# EAGLE design EncoderInterface_J007399_T4 (EAGLE 7.7.0)
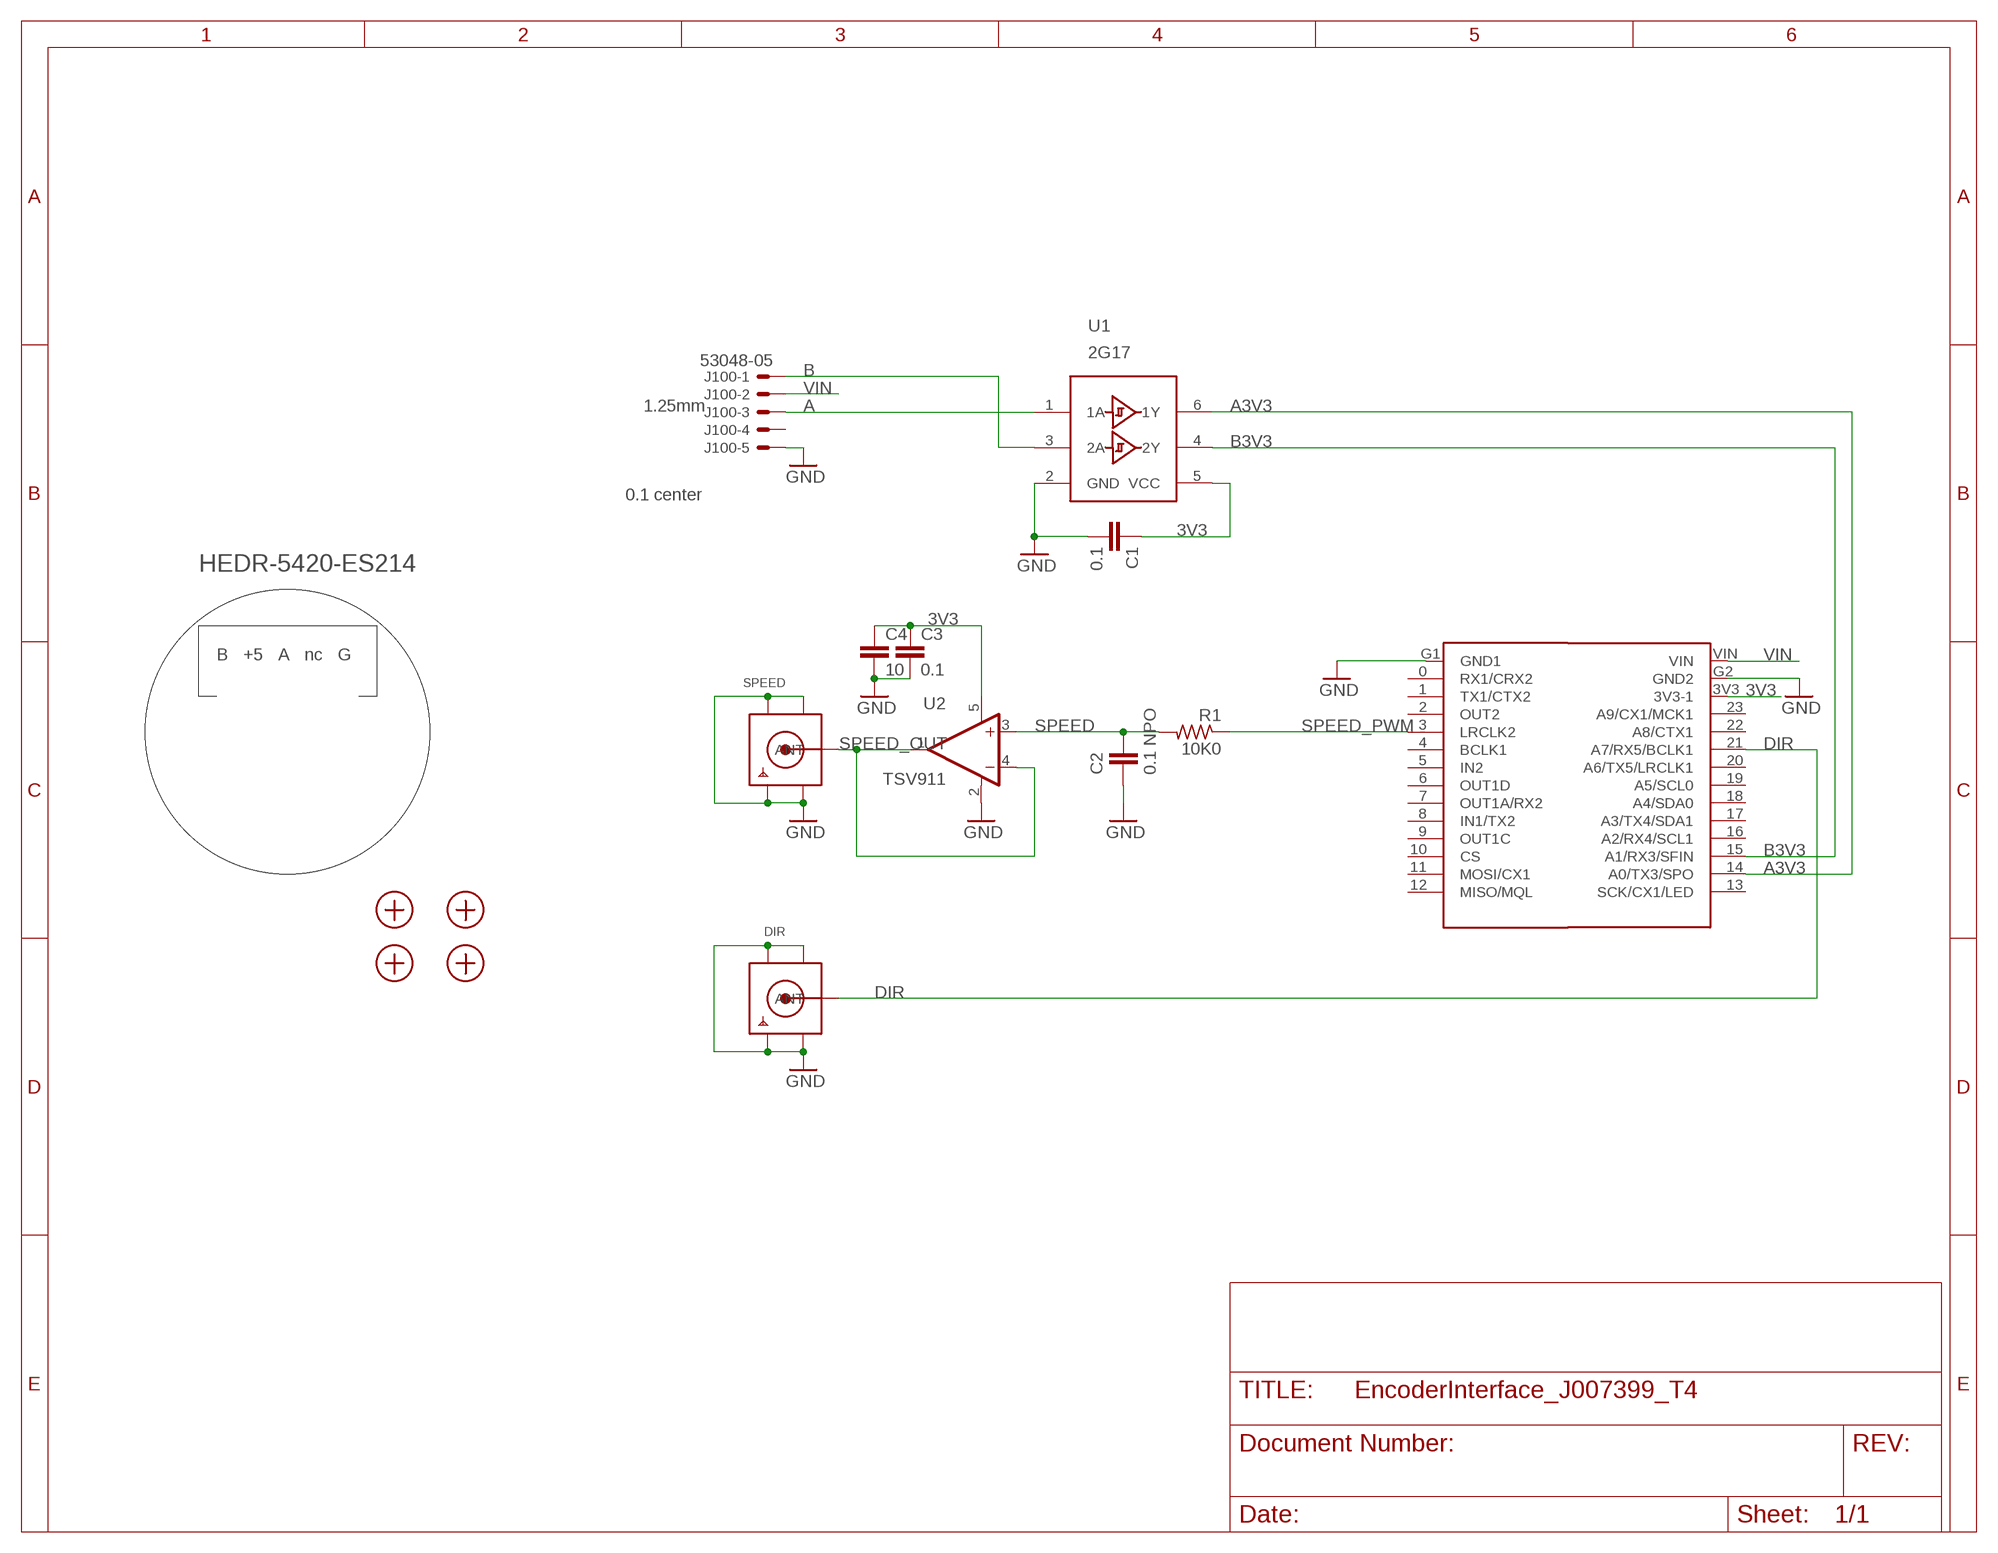
[diagram p0: schematic, sheet 1]

## Parts
C1  0.1  CAPS0603S  [0603S]
C2  0.1 NPO  CAPS1206S  [1206S]
C3  0.1  CAPS0603S  [0603S]
C4  10  CAPS1206S  [1206S]
DIR  SMACONNECTOR  [SMA90_DIP]
J100  53048-05  [53048-05]
M1A  TEENSY40A  [TEENSY40-A]
M1B  TEENSY40B  [TEENSY40-B]
R1  10K0  RESISTOR_SM0805S  [0805S]
S1  SCREW2-56SCREW  [2-56SOCKET]
S2  SCREW2-56SCREW  [2-56SOCKET]
S3  SCREW2-56SCREW  [2-56SOCKET]
S4  SCREW2-56SCREW  [2-56SOCKET]
SPEED  SMACONNECTOR  [SMA90_DIP]
U1  2G17  [SOT23-6]
U2  TSV911  OPA237N  [SOT23-5]

## Nets
3V3: C1.1 C3.1 C4.1 M1B.3V3(3V3-1) U1.5(VCC) U2.5(V+)
A: J100.3 U1.1(1A)
A3V3: M1B.14(A0/TX3/SPO) U1.6(1Y)
B: J100.1 U1.3(2A)
B3V3: M1B.15(A1/RX3/SFIN) U1.4(2Y)
DIR: DIR.ANTENNA(ANT) M1B.21(A7/RX5/BCLK1)
GND: C1.2 C2.2 C3.2 C4.2 DIR.GND1 DIR.GND2 DIR.GND3 DIR.GND4 J100.5 M1A.G1(GND1) M1B.G2(GND2) SPEED.GND1 SPEED.GND2 SPEED.GND3 SPEED.GND4 U1.2(GND) U2.2(V-)
SPEED: C2.1 R1.2 U2.3(+IN)
SPEED_OUT: SPEED.ANTENNA(ANT) U2.1(OUT) U2.4(-IN)
SPEED_PWM: M1A.3(LRCLK2) R1.1
VIN: J100.2 M1B.VIN
Unconnected: J100.4 M1A.0(RX1/CRX2) M1A.1(TX1/CTX2) M1A.2(OUT2) M1A.4(BCLK1) M1A.5(IN2) M1A.6(OUT1D) M1A.7(OUT1A/RX2) M1A.8(IN1/TX2) M1A.9(OUT1C) M1A.10(CS) M1A.11(MOSI/CX1) M1A.12(MISO/MQL) M1B.13(SCK/CX1/LED) M1B.16(A2/RX4/SCL1) M1B.17(A3/TX4/SDA1) M1B.18(A4/SDA0) M1B.19(A5/SCL0) M1B.20(A6/TX5/LRCLK1) M1B.22(A8/CTX1) M1B.23(A9/CX1/MCK1)

## Notes on the sheet
- 1.25mm
- 0.1 center
- HEDR-5420-ES214
- B   +5   A   nc   G

## Library data of the parts
C1-C4 = STEVES_BU:CAPS
DIR SPEED = adafruit:SMACONNECTOR: SMA Connector 90° DIP SMA Connector, 50 Ohm (4UConnector: 07259)
J100 = con-molex:53?-05: CONNECTOR wire to board 1.25 mm (.049 inch) pitch header; MF: MOLEX; MPN: 53048-0510; OC_FARNELL: 9732926; OC_NEWARK: 57H4722
M1A = teensy:TEENSY40A
M1B = teensy:TEENSY40B
R1 = STEVES_BU:RESISTOR_SM
S1-S4 = STEVES_BU:SCREW
U1 = STEVES_BU:2G17
U2 = burr-brown:OPA237: Operational Amplifiers Single-Supply, MicroAmplifier(TM) Series; MF: TEXAS INSTRUMENTS; MPN: OPA237NA/250; OC_FARNELL: 4625298; OC_NEWARK: 35C1874

## Board
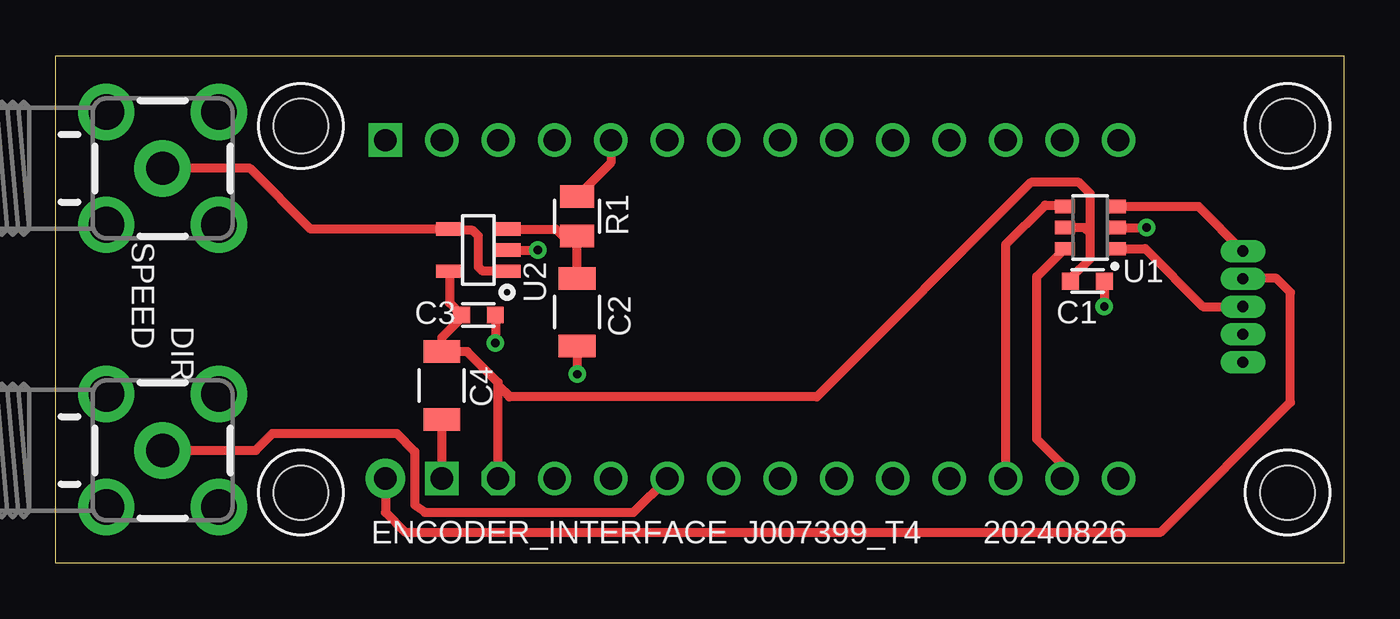
[diagram p1: board, top side]
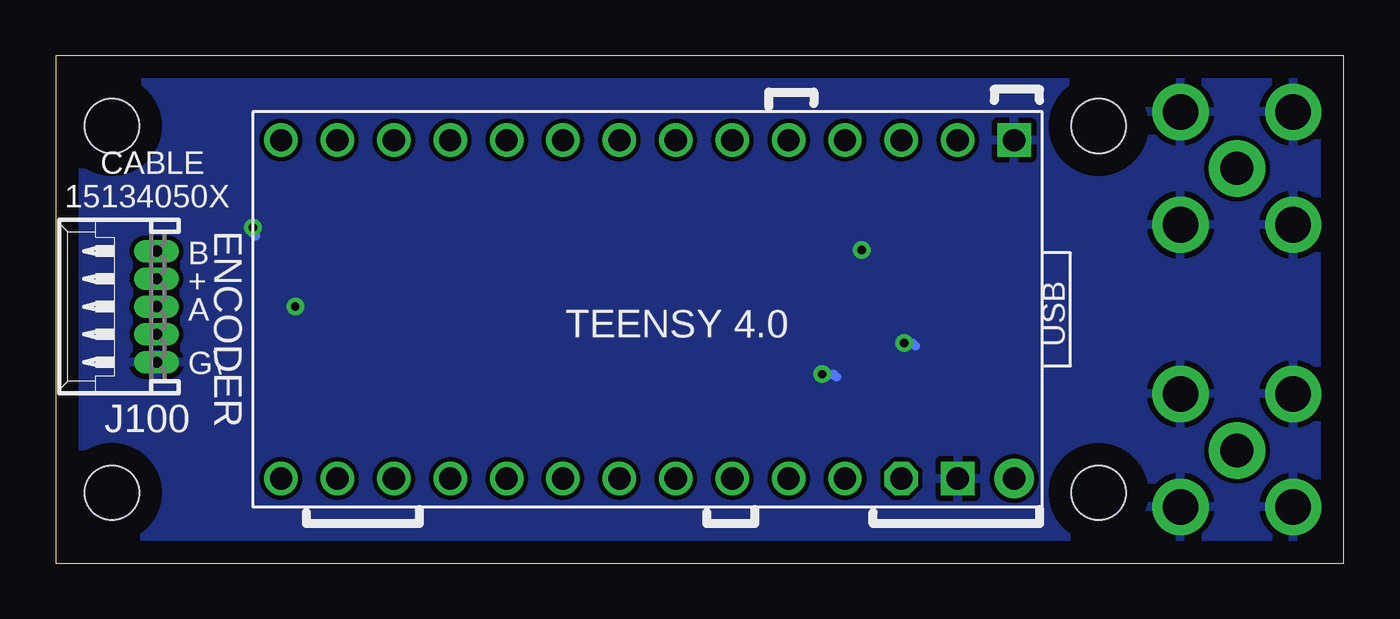
[diagram p2: board, bottom side, seen from below]

Size 58.04 x 22.86 mm. Coordinates in mm from the lower left corner, seen from the top.
Outline: 0,22.86 58.04,22.86 58.04,0 0,0 0,22.86
Copper layers (1*16): Top 0.035mm / dielectric 1.5mm / Bottom 0.035mm
Design rules "default *": minimum track width 10mil, minimum drill 8mil, track to track 8mil, track to pad 8mil, pad to pad 8mil, via to via 8mil, smd to smd 8mil, copper to edge 40mil, drill to drill 8mil, minimum pad ring 10mil, minimum via ring 8mil, stop-mask expansion 4mil, vias tented up to drill 0mil, thermal gap 10mil

### Footprints (pad centres in the part's own frame; a part is rotated, then mirrored left to right if it is on the bottom)
0603S = smd 0.762 x 0.762: 1 -0.762,0; 2 0.762,0
1206S = smd 1.016 x 1.651: 1 -1.524,0; 2 1.524,0
SMA90_DIP = drill 1.5 pad 2.54: ANTENNA 0,0 | drill 1.6 pad 2.54: GND1 -2.54,2.54; GND2 2.54,2.54; GND3 -2.54,-2.54; GND4 2.54,-2.54
53048-05 = drill 0.5 pad 0.698 long: 1 2.5,-1.25; 2 1.25,-1.25; 3 0,-1.25; 4 -1.25,-1.25; 5 -2.5,-1.25
TEENSY40-A = drill 1: 0 -13.97,-7.62; 1 -11.43,-7.62; 2 -8.89,-7.62; 3 -6.35,-7.62; 4 -3.81,-7.62; 5 -1.27,-7.62; 6 1.27,-7.62; 7 3.81,-7.62; 8 6.35,-7.62; 9 8.89,-7.62; 10 11.43,-7.62; 11 13.97,-7.62; 12 16.51,-7.62 | drill 1 square: G1 -16.51,-7.62
TEENSY40-B = drill 1 octagon: 3V3 -11.43,7.62 | drill 1: 13 16.51,7.62; 14 13.97,7.62; 15 11.43,7.62; 16 8.89,7.62; 17 6.35,7.62; 18 3.81,7.62; 19 1.27,7.62; 20 -1.27,7.62; 21 -3.81,7.62; 22 -6.35,7.62; 23 -8.89,7.62 | drill 1 square: G2 -13.97,7.62 | drill 1 pad 1.778: VIN -16.51,7.62
0805S = smd 1.016 x 1.524: 1 -0.889,0; 2 0.889,0
2-56SOCKET = hole 2.438: 0,0
SOT23-6 = smd 0.6 x 0.9: 1 -0.95,-1.15; 2 0,-1.15; 3 0.95,-1.15; 4 0.95,1.15; 5 0,1.15; 6 -0.95,1.15
SOT23-5 = smd 0.6 x 1.2: 1 -0.95,-1.306; 2 0,-1.306; 3 0.95,-1.306; 4 0.95,1.306; 5 -0.95,1.306

### Placement (x,y rotation side)
C1  46.48,12.7 0 top
C2  23.5,11.3 270 top
C3  19.05,11.18 0 top
C4  17.4,8 270 top
DIR  4.83,5.08 90 top
J100  54.74,11.56 90 bottom
M1A  31.37,11.43 180 bottom
M1B  31.37,11.43 180 bottom
R1  23.5,15.62 270 top
S1  11.05,19.68 0 top
S2  55.5,19.68 0 top
S3  11.05,3.17 0 top
S4  55.5,3.17 0 top
SPEED  4.83,17.78 90 top
U1  46.61,15.11 90 top
U2  19.05,14.1 90 top

### Tracks (layer width: path | path; a pad name or v marks a point on that pad's centre or on a via)
3V3
  Top 0.406: C1.1 45.72,12.83 46.61,13.72 46.61,14.86 | 46.61,14.86 46.35,15.11 U1.5 | U2.5 17.74,11.72 C3.1 18.29,11.05 17.4,10.16 C4.1 18.54,9.53 19.94,8.13 19.94,8 | M1B.3V3 19.94,8 | 46.61,14.86 46.61,16.64 46.1,17.14 43.94,17.14 34.29,7.49 20.45,7.49 19.94,8
A
  Top 0.406: U1.1 49.08,14.16 51.69,11.56 J100.3
A3V3
  Top 0.406: M1B.14 45.34,4.45 44.2,5.59 44.2,12.9 U1.6
B
  Top 0.406: U1.3 51.48,16.06 J100.1
B3V3
  Top 0.406: M1B.15 42.8,14.35 44.58,16.13 45.39,16.13 U1.4
DIR
  Top 0.406: DIR.ANTENNA 9.02,5.08 9.78,5.84 15.37,5.84 16.18,5.03 16.18,2.62 16.64,2.29 26.04,2.29 M1B.21
GND  (via drill 0.38)
  Top 0.406: C4.2 M1B.G2 | C3.2 v19.81,9.91 | C2.2 v23.5,8.51 | U2.2 v21.72,14.1 | U1.2 v49.15,15.11 | C1.2 v47.24,11.56
  Bottom 0.406: v19.81,9.91 19.43,9.91 19.3,9.78 | v23.5,8.51 22.99,8.51 22.86,8.38 | v21.72,14.1 21.59,13.97 | v49.15,15.11 49.15,14.86 49.02,14.73 | v47.24,11.56 47.12,11.43
  pour Bottom: -2.79,24.13 59.44,24.13 59.44,-3.81 -2.79,-3.81
SPEED
  Top 0.406: C2.1 R1.2 22.86,14.73 22.55,15.05 U2.3
SPEED_OUT
  Top 0.406: U2.1 19.24,13.15 19.05,13.34 19.05,14.73 18.8,14.99 17.8,14.99 U2.4 11.5,15.05 8.76,17.78 SPEED.ANTENNA
SPEED_PWM
  Top 0.406: M1A.3 25.02,18.03 R1.1
VIN
  Top 0.406: M1B.VIN 14.86,2.29 15.75,1.4 49.78,1.4 55.63,7.24 55.63,12.19 54.99,12.83 53.51,12.83 J100.2

### Text on the board
tPlace: ENCODER_INTERFACE | J007399_T4 | 20240826
bPlace: CABLE / 15134050X | ENCODER | B | + | A | G\